# EAGLE schematic timetwister (EAGLE 6.6.0)
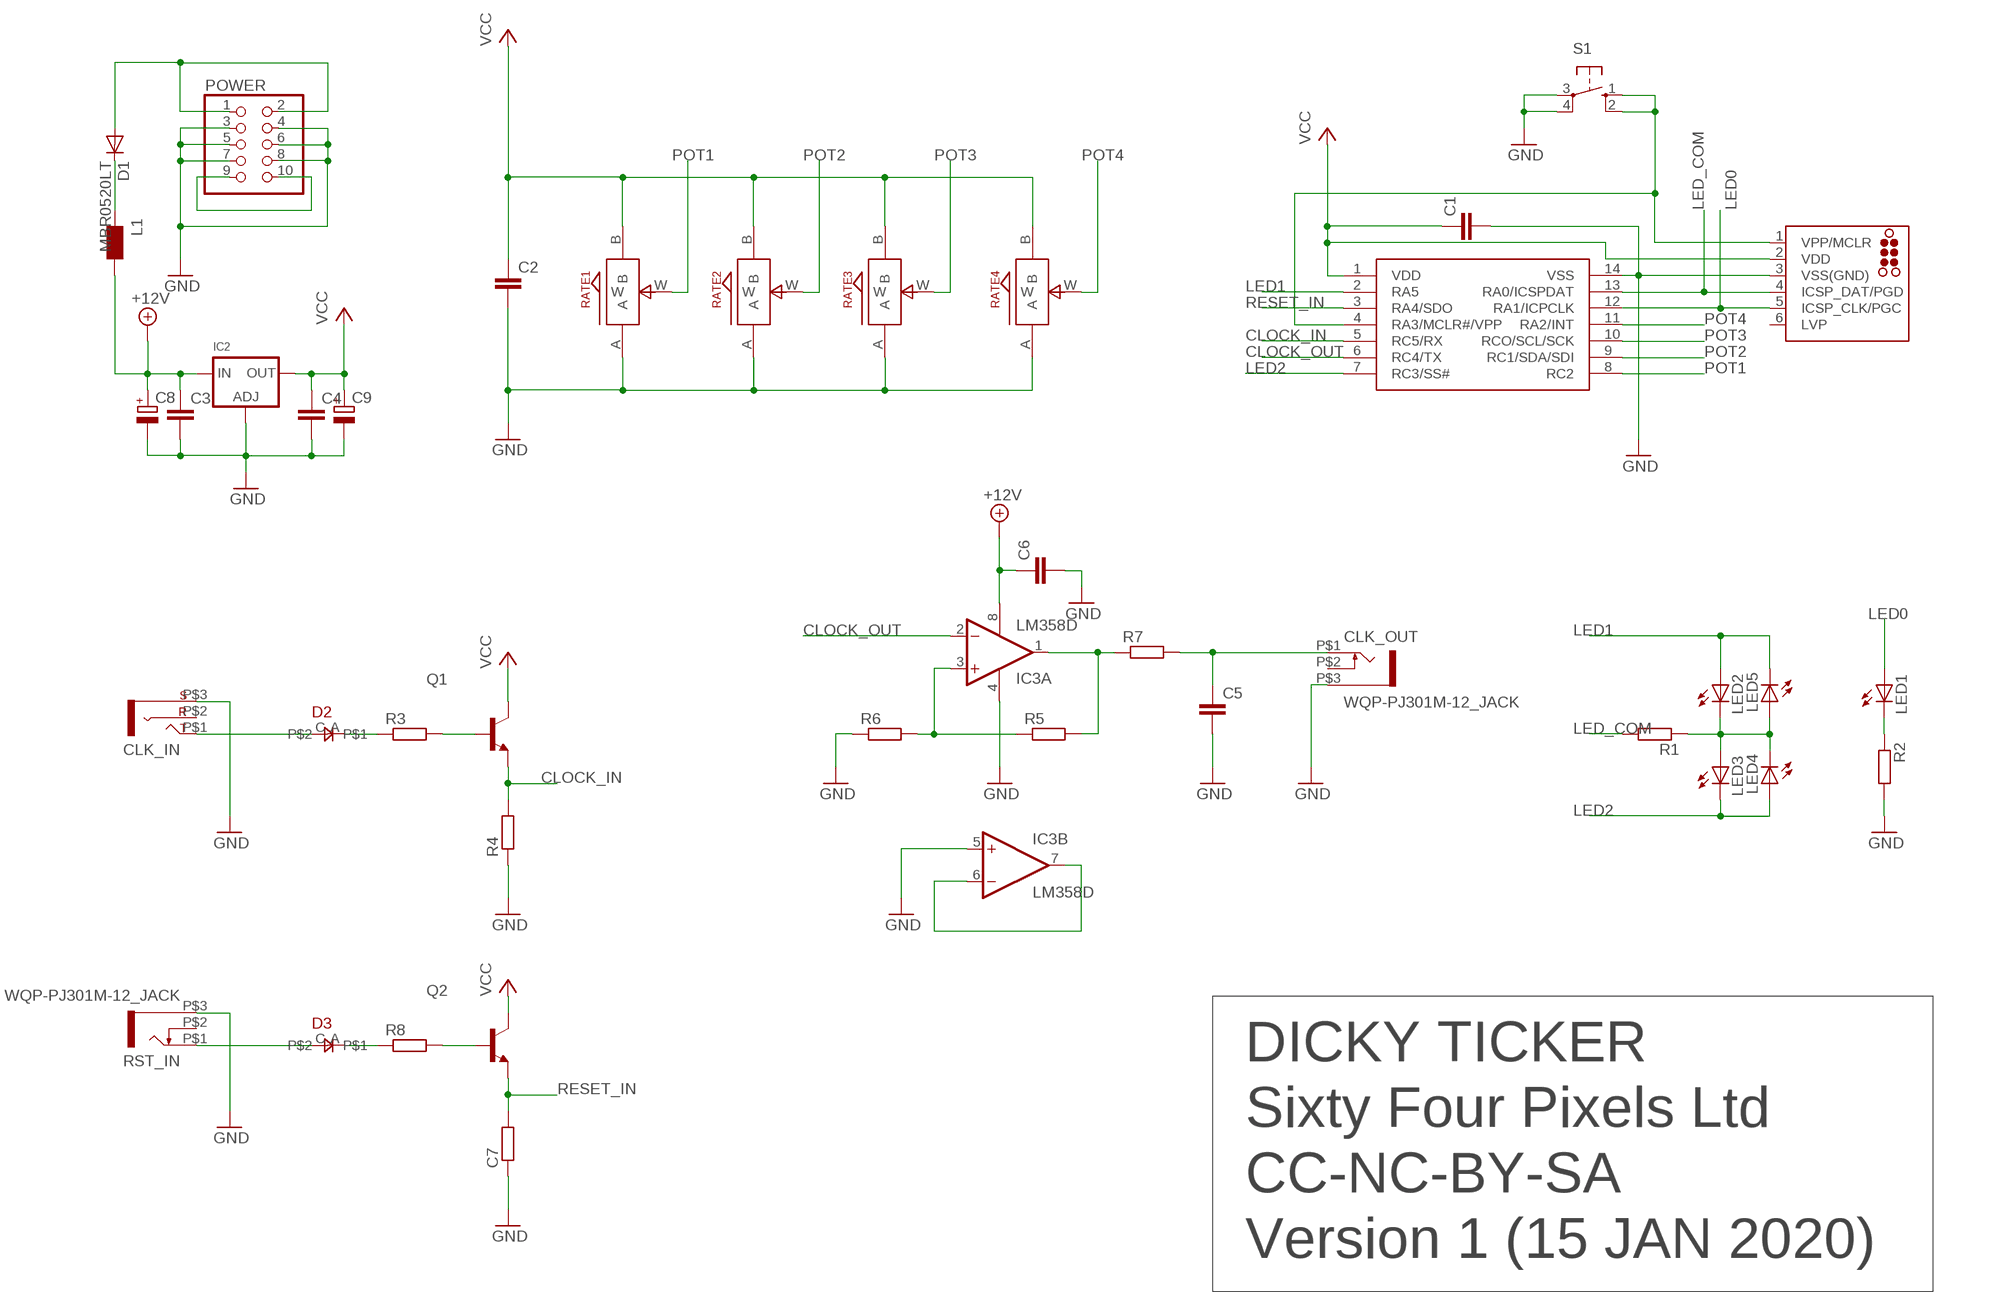
[diagram p0: schematic, sheet 1]

## Parts
C1  C-EUC0805  [C0805]
C2  C-EUC0805  [C0805]
C3  C-EUC0805  [C0805]
C4  C-EUC0805  [C0805]
C5  C-EUC0805  [C0805]
C6  C-EUC0805  [C0805]
C7  R-EU_R0805  [R0805]
C8  CPOL-EUE2-5  [E2-5]
C9  CPOL-EUE2-5  [E2-5]
CLK_IN  THONKICONN_STEREO  [WQP-PJ301M-ST]
CLK_OUT  WQP-PJ301M-12_JACK  [WQP-PJ301M-12_JACK]
D1  MBR0520LT  [SOD123]
D2  0805DIODE  [0805DIODE]
D3  0805DIODE  [0805DIODE]
IC1  PIC16F1825SO14  [SO14]
IC2  LM1117SOT223-WAVE  [SOT223-W]
IC3  LM358D  [SO08]
ICSP  TC2030-MCP-NL  [TC2030-MCP-NL]
L1  WE-CBF_0805  [0805]
LED1  LED3MM  [LED3MM]
LED2  LED3MM  [LED3MM]
LED3  LED3MM  [LED3MM]
LED4  LED3MM  [LED3MM]
LED5  LED3MM  [LED3MM]
POWER  PINHD-2X5  [2X05]
Q1  MMBT3904LT1-NPN-SOT23-BEC  [SOT23-BEC]
Q2  MMBT3904LT1-NPN-SOT23-BEC  [SOT23-BEC]
R1  R-EU_R0805  [R0805]
R2  R-EU_R0805  [R0805]
R3  R-EU_R0805  [R0805]
R4  R-EU_R0805  [R0805]
R5  R-EU_R0805  [R0805]
R6  R-EU_R0805  [R0805]
R7  R-EU_R0805  [R0805]
R8  R-EU_R0805  [R0805]
RATE1  ALPS_POT_SMALL  [SMALL_ALPS_POT]
RATE2  ALPS_POT_SMALL  [SMALL_ALPS_POT]
RATE3  ALPS_POT_SMALL  [SMALL_ALPS_POT]
RATE4  ALPS_POT_SMALL  [SMALL_ALPS_POT]
RST_IN  WQP-PJ301M-12_JACK  [WQP-PJ301M-12_JACK]
S1  10-XX  [B3F-10XX]

## Nets
+12V: C3.1 C6.1 C8.+ IC2.3(IN) IC3.8(P:V+) L1.2
CLOCK_IN: IC1.5(RC5/RX) Q1.E R4.2
CLOCK_OUT: IC1.6(RC4/TX) IC3.2(A:-IN)
GND: C1.2 C2.2 C3.2 C4.2 C5.2 C6.2 C7.1 C8.- C9.- CLK_IN.P$3(S) CLK_OUT.P$3 IC1.14(VSS) IC2.1(ADJ) IC3.4(P:V-) IC3.5(B:+IN) ICSP.3(VSS(GND)) POWER.3 POWER.4 POWER.5 POWER.6 POWER.7 POWER.8 R2.2 R4.1 R6.1 RATE1.A RATE2.A RATE3.A RATE4.A RST_IN.P$3 S1.3(P) S1.4(P1)
LED0: IC1.12(RA1/ICPCLK) ICSP.5(ICSP_CLK/PGC) LED1.A
LED1: IC1.2(RA5) LED2.A LED5.K(C)
LED2: IC1.7(RC3/SS#) LED3.K(C) LED4.A
LED_COM: IC1.13(RA0/ICSPDAT) ICSP.4(ICSP_DAT/PGD) R1.2
N$1: CLK_IN.P$1(T) D2.C
N$2: D2.A R3.1
N$3: Q1.B R3.2
N$4: D3.A R8.1
N$5: Q2.B R8.2
N$6: IC3.3(A:+IN) R5.1 R6.2
N$7: D3.C RST_IN.P$1
N$8: IC3.6(B:-IN) IC3.7(B:OUT)
N$9: LED1.K(C) R2.1
N$10: IC3.1(A:OUT) R5.2 R7.1
N$11: C5.1 CLK_OUT.P$1 R7.2
N$12: POWER.9 POWER.10
N$13: D1.A POWER.1 POWER.2
N$14: LED2.K(C) LED3.A LED4.K(C) LED5.A R1.1
N$15: D1.C L1.1
N$19: IC1.4(RA3/MCLR#/VPP) ICSP.1(VPP/MCLR) S1.1(S) S1.2(S1)
POT1: IC1.8(RC2) RATE1.W
POT2: IC1.9(RC1/SDA/SDI) RATE2.W
POT3: IC1.10(RCO/SCL/SCK) RATE3.W
POT4: IC1.11(RA2/INT) RATE4.W
RESET_IN: C7.2 IC1.3(RA4/SDO) Q2.E
VCC: C1.1 C2.1 C4.1 C9.+ IC1.1(VDD) IC2.2(OUT) ICSP.2(VDD) Q1.C Q2.C RATE1.B RATE2.B RATE3.B RATE4.B
Unconnected: CLK_IN.P$2(R) CLK_OUT.P$2 ICSP.6(LVP) RST_IN.P$2

## Notes on the sheet
- DICKY TICKER
- Sixty Four Pixels Ltd
- CC-NC-BY-SA
- Version 1 (15 JAN 2020)

## Library data of the parts
C1-C6 = rcl:C-EU: CAPACITOR, European symbol
C7 R1-R8 = rcl:R-EU_: RESISTOR, European symbol
C8 C9 = rcl:CPOL-EU: POLARIZED CAPACITOR, European symbol
CLK_IN = jason_eagle6:THONKICONN_STEREO
CLK_OUT RST_IN = thonkiconn:WQP-PJ301M-12_JACK
D1 = diode:MBR0520LT: SCHOTTKY BARRIER RECTIFIER Source: http://onsemi.com .. MBR0520LT1-D.pdf
D2 D3 = jasons_stuff:0805DIODE
IC1 = jasons_stuff:PIC16F1825
IC2 = microbuilder:LM1117: LM1117 Voltage Regulator LM1117 Adjustable Voltage regulator [Digikey: LM1117IMP-ADJDKR-ND] LM1117 3.3V Voltage regulator [AP1117E33GDIDKR-ND] LM1117 5.0V Voltage regulator [AP1117E50GDIDKR-ND] SOT223-REFLOW - SOT223 package for solder paste/reflow ovens SOT223-WAVE - SOT223 package for hand-soldering (larger pads) Note: For the fixed-voltage regulators, simply set the ADJ pin to GND.
IC3 = linear:LM358: OP AMP also LM158; LM258; LM2904 Source: http://cache.national.com/ds/LM/LM158.pdf
ICSP = tag-connect:TC2030: TAG-CONNECT ICSP Connector Manufacturer: Tag-Connect <http://www.tag-connect.com> Cable for easy In-Circuit Serial Programming. Designed for Microchip ICD2, suitable for many others. Two variants - one "with legs" (for hands-free fit on PCB) and another "without legs" for quick programming. PAD Description 1 MCLR/Vpp 2 Vdd 3 GND 4 PGD (ISPDAT) 5 PGC (ISPCLK) 6 nc (used for LVP) ©2009 ROFA.cz - modified and updated by Robert Darlington ‹rdarlington@gmail.com›
L1 = wuerth-elektronik:WE-CBF: SMD EMI Suppression Ferrite Beads - excellent anti-EMI properties - low DCR - impedances till 3000 ohms - rated current up to 6 A
LED1-LED5 = led:LED: LED OSRAM: - CHIPLED LG R971, LG N971, LY N971, LG Q971, LY Q971, LO R971, LY R971 LH N974, LH R974 LS Q976, LO Q976, LY Q976 LO Q996 - Hyper CHIPLED LW Q18S LB Q993, LB Q99A, LB R99A - SideLED LS A670, LO A670, LY A670, LG A670, LP A670 LB A673, LV A673, LT A673, LW A673 LH A674 LY A675 LS A676, LA A676, LO A676, LY A676, LW A676 LS A679, LY A679, LG A679 - Hyper Micro SIDELED® LS Y876, LA Y876, LO Y876, LY Y876 LT Y87S - SmartLED LW L88C, LW L88S LB L89C, LB L89S, LG L890 LS L89K, LO L89K, LY L89K LS L896, LA L896, LO L896, LY L896 - TOPLED LS T670, LO T670, LY T670, LG T670, LP T670 LSG T670, LSP T670, LSY T670, LOP T670, LYG T670 LG T671, LOG T671, LSG T671 LB T673, LV T673, LT T673, LW T673 LH T674 LS T676, LA T676, LO T676, LY T676, LB T676, LH T676, LSB T676, LW T676 LB T67C, LV T67C, LT T67C, LS T67K, LO T67K, LY T67K, LW E67C LS E67B, LA E67B, LO E67B, LY E67B, LB E67C, LV E67C, LT E67C LW T67C LS T679, LY T679, LG T679 LS T770, LO T770, LY T770, LG T770, LP T770 LB T773, LV T773, LT T773, LW T773 LH T774 LS E675, LA E675, LY E675, LS T675 LS T776, LA T776, LO T776, LY T776, LB T776 LHGB T686 LT T68C, LB T68C - Hyper Mini TOPLED® LB M676 - Mini TOPLED Santana® LG M470 LS M47K, LO M47K, LY M47K Source: http://www.osram.convergy.de LUXEON: - LUMILED® LXK2-PW12-R00, LXK2-PW12-S00, LXK2-PW14-U00, LXK2-PW14-V00 LXK2-PM12-R00, LXK2-PM12-S00, LXK2-PM14-U00 LXK2-PE12-Q00, LXK2-PE12-R00, LXK2-PE12-S00, LXK2-PE14-T00, LXK2-PE14-U00 LXK2-PB12-K00, LXK2-PB12-L00, LXK2-PB12-M00, LXK2-PB14-N00, LXK2-PB14-P00, LXK2-PB14-Q00 LXK2-PR12-L00, LXK2-PR12-M00, LXK2-PR14-Q00, LXK2-PR14-R00 LXK2-PD12-Q00, LXK2-PD12-R00, LXK2-PD12-S00 LXK2-PH12-R00, LXK2-PH12-S00 LXK2-PL12-P00, LXK2-PL12-Q00, LXK2-PL12-R00 Source: www.luxeon.com KINGBRIGHT: KA-3528ASYC Source: www.kingbright.com
POWER = pinhead:PINHD-2X5: PIN HEADER
Q1 Q2 = transistor-neu-to92:*-NPN-: NPN Transistror
RATE1-RATE4 = jasons_stuff:ALPS_POT_SMALL
S1 = switch-omron:10-XX: OMRON SWITCH; MPN: B3F-1000; OC_FARNELL: 176432; OC_NEWARK: 36M3542